# Altium schematic sheet LED_ZuTu-7.0.SchDoc
size A4
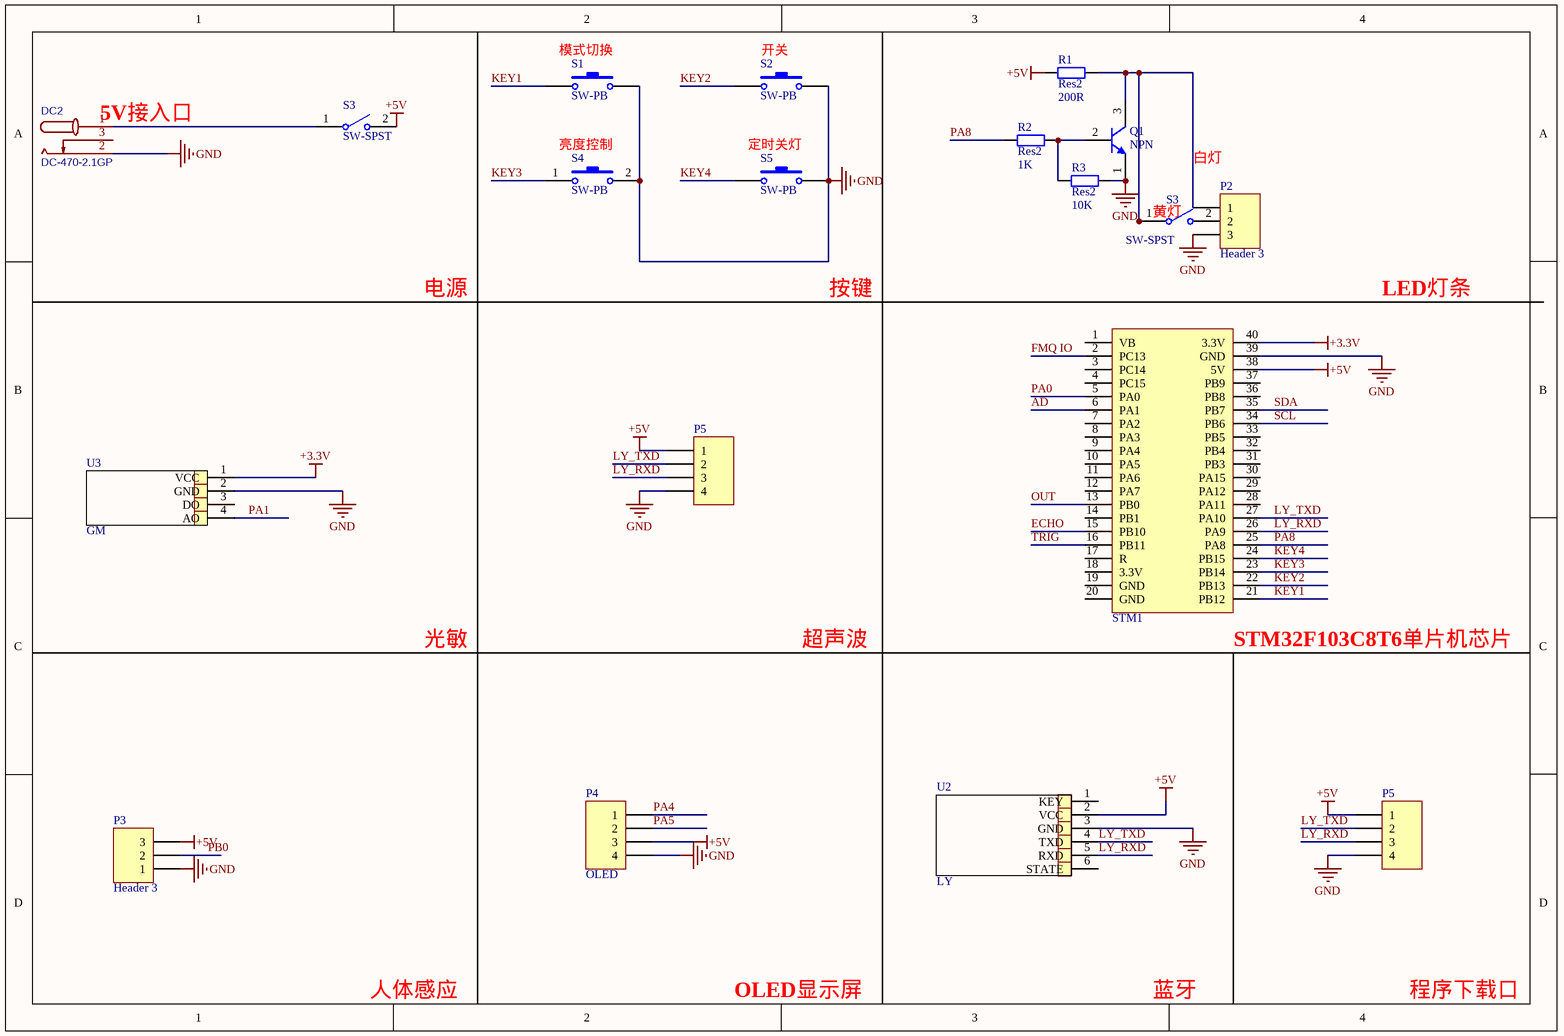
[diagram p0: LED_ZuTu-7.0.SchDoc]

## Parts
(Parts that share a designator on the sheet are numbered #1, #2 ... from top to bottom, then left to right.)
DC2  DC-470-2.1GP  [DC-470-2.1GP - duplicate]
P2  Header 3  [HDR1X3]
P3  Header 3  [HDR1X3]
P4  OLED  [HDR1X4]
P5#1  (no value)  [HDR1X4]
P5#2  (no value)  [HDR1X4]
Q1  NPN  [SOT-23R]
R1  Res2  value 200R  [0805]
R2  Res2  value 1K  [0805]
R3  Res2  value 10K  [0805]
S1  SW-PB  [KEY_M]
S2  SW-PB  [KEY_M]
S3#1  SW-SPST  [BTN8.5*8.5]
S3#2  SW-SPST  [BTN8.5*8.5]
S4  SW-PB  [KEY_M]
S5  SW-PB  [KEY_M]
STM1  stm32f103c8t6_Board  [stm32-port]  (value not drawn)
U2  LY  [HDR1X6]
U3  GM  [HDR1X4]

## Nets
+3.3V: STM1.40(3.3V) U3.1(VCC)
+5V: P3.3 P4.3 P5#1.1 P5#2.1 R1.1 S3#1.2(NO) STM1.38(5V) U2.2(VCC)
GND: DC2.2 P2.3 P3.1 P4.4 P5#1.4 P5#2.4 Q1.1(E) R3.2 S1.2 S2.2 S4.2 S5.2 STM1.39(GND) U2.3(GND) U3.2(GND)
AD: STM1.6(PA1)
ECHO: STM1.15(PB10)
FMQ IO: STM1.2(PC13)
KEY1: S1.1 STM1.21(PB12)
KEY2: S2.1 STM1.22(PB13)
KEY3: S4.1 STM1.23(PB14)
KEY4: S5.1 STM1.24(PB15)
LY_RXD: P5#1.3 P5#2.3 STM1.26(PA9) U2.5(RXD)
LY_TXD: P5#1.2 P5#2.2 STM1.27(PA10) U2.4(TXD)
OUT: STM1.13(PB0)
PA0: STM1.5(PA0)
PA1: U3.4(AO)
PA4: P4.1
PA5: P4.2
PA8: R2.1 STM1.25(PA8)
PB0: P3.2
SCL: STM1.34(PB6)
SDA: STM1.35(PB7)
TRIG: STM1.16(PB11)
NetDC2_1: DC2.1 S3#1.1(COMMON)
NetP2_1: P2.1 Q1.3(C) R1.2 S3#2.1(COMMON)
NetQ1_2: Q1.2(B) R2.2 R3.1

Not connected (* = marked no-connect by the designer): DC2 3; P2 2; S3#2 2(NO); STM1 1(VB) 3(PC14) 4(PC15) 7(PA2) 8(PA3) 9(PA4) 10(PA5) 11(PA6) 12(PA7) 14(PB1) 17(R) 18(3.3V) 19(GND) 20(GND) 28(PA11) 29(PA12) 30(PA15) 31(PB3) 32(PB4) 33(PB5) 36(PB8) 37(PB9); U2 1(KEY) 6(STATE); U3 3(DO)

## Notes on the sheet
- (near S1) 模式切换
- (near S2) 开关
- (near DC2) 5V接入口
- (near S4) 亮度控制
- (near S5) 定时关灯
- 白灯
- (near S3#2) 黄灯
- 电源
- 按键
- LED灯条
- 光敏
- 超声波
- (near STM1) STM32F103C8T6单片机芯片
- 人体感应
- OLED显示屏
- 蓝牙
- 程序下载口

## Library data of the parts
DC2 = DC-470-2.1GP: BOM_Manufacturer: GANGYUAN; Contributor: LCSC; BOM_Supplier: LCSC; BOM_Supplier Part: C194407; BOM_Manufacturer Part: DC-470-2.1GP; spicePre: D
P2 P3 = Header 3: Header, 3-Pin; LatestRevisionDate: 17-Jul-2002; LatestRevisionNote: Re-released for DXP Platform.; Publisher: Altium Limited
P4 P5#1 P5#2 = Header 4: Header, 4-Pin; LatestRevisionDate: 17-Jul-2002; LatestRevisionNote: Re-released for DXP Platform.; Publisher: Altium Limited
Q1 = NPN: NPN Bipolar Transistor; Published: 8-Jun-2000; LatestRevisionDate: 17-Jul-2002; LatestRevisionNote: Re-released for DXP Platform.; PackageReference: TO-226-AA; Publisher: Altium Limited; PackageDescription: TO, Flat Index; 3 In-Line, Axial Leads; Body Dia. 4.8mm; Leads 0.55 x 0.51 mm (max); Code_JEDEC: TO-226-AA
R1-R3 = Res2: 贴片电阻8050; Published: 8-Jun-2000; LatestRevisionDate: 17-Jul-2002; LatestRevisionNote: Re-released for DXP Platform.; PackageReference: AXIAL-0.4; Publisher: Altium Limited; PackageDescription: Axial Device, Thru-Hole; 2 Leads; 0.4 in Pin Spacing
S1 S2 S4 S5 = SW-PB: Switch; Published: 24-Mar-1999; LatestRevisionDate: 17-Jul-2002; LatestRevisionNote: Re-released for DXP Platform.; PackageReference: SPST-2; Publisher: Altium Limited; PackageDescription: Switch; 2 Leads
S3#1 S3#2 = SW-SPST: Single-Pole, Single-Throw Switch; Published: 24-Mar-1999; LatestRevisionDate: 17-Jul-2002; LatestRevisionNote: Re-released for DXP Platform.; PackageReference: SPST-2; Publisher: Altium Limited; PackageDescription: Switch; 2 Leads
STM1 = stm32f103c8t6_Board: MCU